# EAGLE design pcb_1-1.0 (EAGLE 5.02)
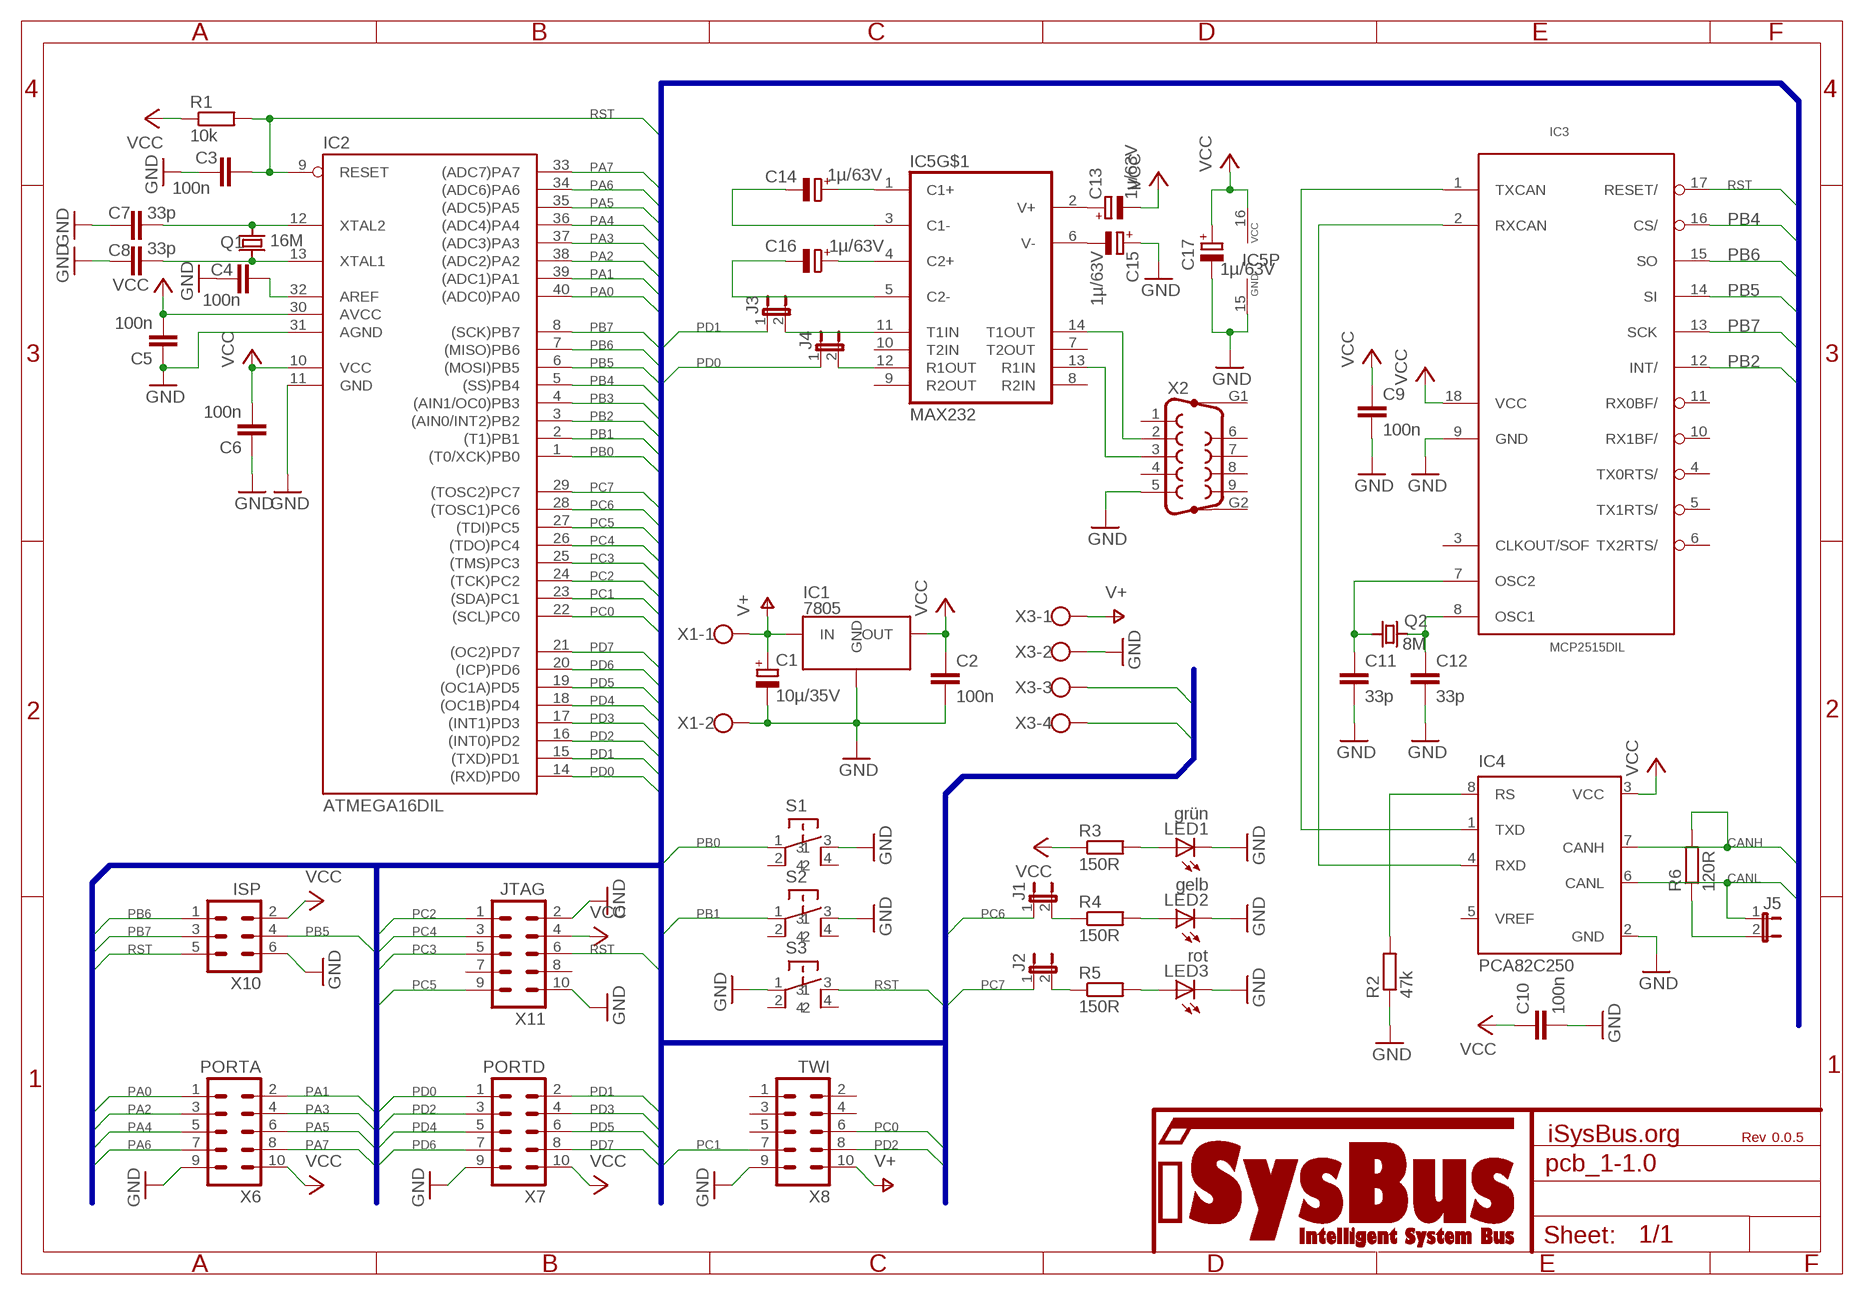
[diagram p0: schematic, sheet 1]

## Parts
C1  10µ/35V  CPOLE2-5  [E2-5]
C2  100n  C050-030X075  [C050-030X075]
C3  100n  C050-030X075  [C050-030X075]
C4  100n  C050-030X075  [C050-030X075]
C5  100n  C050-030X075  [C050-030X075]
C6  100n  C050-030X075  [C050-030X075]
C7  33p  C025-025X050  [C025-025X050]
C8  33p  C025-025X050  [C025-025X050]
C9  100n  C050-030X075  [C050-030X075]
C10  100n  C050-030X075  [C050-030X075]
C11  33p  C025-025X050  [C025-025X050]
C12  33p  C025-025X050  [C025-025X050]
C13  1µ/63V  CPOLE2.5-5  [E2,5-5]
C14  1µ/63V  CPOLE2.5-5  [E2,5-5]
C15  1µ/63V  CPOLE2.5-5  [E2,5-5]
C16  1µ/63V  CPOLE2.5-5  [E2,5-5]
C17  1µ/63V  CPOLE2.5-5  [E2,5-5]
IC1  7805  [TO220]
IC2  ATMEGA16DIL  [DIL40]
IC3  MCP2515DIL  [DIL18]
IC4  PCA82C250  [DIL08]
IC5  MAX232  [DIL16]
J1  J1  [J1]
J2  J1  [J1]
J3  J1  [J1]
J4  J1  [J1]
J5  J1  [J1]
LED1  grün  LED3MM  [LED3MM]
LED2  gelb  LED3MM  [LED3MM]
LED3  rot  LED3MM  [LED3MM]
Q1  16M  Q  [HC49U-V]
Q2  8M  Q  [HC49U-V]
R1  10k  R-0207/10  [0207/10]
R2  47k  R-0207/10  [0207/10]
R3  150R  R-0207/10  [0207/10]
R4  150R  R-0207/10  [0207/10]
R5  150R  R-0207/10  [0207/10]
R6  120R  R-0207/10  [0207/10]
S1  PHAP3301  [PHAP3301]
S2  PHAP3301  [PHAP3301]
S3  PHAP3301  [PHAP3301]
U$1  ISYSBUS_LOGO  [ISYSBUS_LOGO]
U$2  0.0.5  REVISION_FIELD  [REVISION_FIELD]
X1  AKL-02_101-02  [AKL-02]
X2  F09HP  [F09HP]
X3  AKL-04_101-04  [AKL-04]
X6  PORTA  ML10  [ML10]
X7  PORTD  ML10  [ML10]
X8  TWI  ML10  [ML10]
X10  ISP  ML6  [ML6]
X11  JTAG  ML10  [ML10]

## Nets
CANH: IC4.7(CANH) R6.2 X3.3
CANL: IC4.6(CANL) J5.1 X3.4
GND: C1.- C2.2 C3.1 C4.1 C5.1 C6.1 C7.2 C8.2 C9.2 C10.2 C11.2 C12.2 C15.+ C17.- IC1.2(GND) IC2.11(GND) IC2.31(AGND) IC3.9(GND) IC4.2(GND) IC5.15(P:GND) LED1.K(C) LED2.K(C) LED3.K(C) R2.1 S1.3 S2.3 S3.1 X1.2 X2.5 X3.2 X6.9 X7.9 X8.9 X10.6 X11.2 X11.10
N$1: IC5.13(R1IN) X2.3
N$2: IC5.14(T1OUT) X2.2
N$3: J5.2 R6.1
N$4: LED1.A R3.2
N$5: LED2.A R4.2
N$6: C4.2 IC2.32(AREF)
N$7: LED3.A R5.2
N$8: C8.1 IC2.13(XTAL1) Q1.2
N$9: C7.1 IC2.12(XTAL2) Q1.1
N$10: J1.2 R4.1
N$11: C12.1 IC3.8(OSC1) Q2.2
N$12: C11.1 IC3.7(OSC2) Q2.1
N$13: IC3.1(TXCAN) IC4.1(TXD)
N$14: IC3.2(RXCAN) IC4.4(RXD)
N$15: J2.2 R5.1
N$16: IC4.8(RS) R2.2
N$17: C14.+ IC5.1(C1+)
N$18: C16.+ IC5.4(C2+)
N$19: C14.- IC5.3(C1-)
N$20: C16.- IC5.5(C2-)
N$21: C13.+ IC5.2(V+)
N$22: C15.- IC5.6(V-)
N$23: IC5.12(R1OUT) J4.2
N$24: IC5.11(T1IN) J3.2
PA0: IC2.40((ADC0)PA0) X6.1
PA1: IC2.39((ADC1)PA1) X6.2
PA2: IC2.38((ADC2)PA2) X6.3
PA3: IC2.37((ADC3)PA3) X6.4
PA4: IC2.36((ADC4)PA4) X6.5
PA5: IC2.35((ADC5)PA5) X6.6
PA6: IC2.34((ADC6)PA6) X6.7
PA7: IC2.33((ADC7)PA7) X6.8
PB0: IC2.1((T0/XCK)PB0) S1.1
PB1: IC2.2((T1)PB1) S2.1
PB2: IC2.3((AIN0/INT2)PB2) IC3.12(INT/)
PB3: IC2.4((AIN1/OC0)PB3)
PB4: IC2.5((SS)PB4) IC3.16(CS/)
PB5: IC2.6((MOSI)PB5) IC3.14(SI) X10.4
PB6: IC2.7((MISO)PB6) IC3.15(SO) X10.1
PB7: IC2.8((SCK)PB7) IC3.13(SCK) X10.3
PC0: IC2.22((SCL)PC0) X8.6
PC1: IC2.23((SDA)PC1) X8.7
PC2: IC2.24((TCK)PC2) X11.1
PC3: IC2.25((TMS)PC3) X11.5
PC4: IC2.26((TDO)PC4) X11.3
PC5: IC2.27((TDI)PC5) X11.9
PC6: IC2.28((TOSC1)PC6) J1.1
PC7: IC2.29((TOSC2)PC7) J2.1
PD0: IC2.14((RXD)PD0) J4.1 X7.1
PD1: IC2.15((TXD)PD1) J3.1 X7.2
PD2: IC2.16((INT0)PD2) X7.3 X8.8
PD3: IC2.17((INT1)PD3) X7.4
PD4: IC2.18((OC1B)PD4) X7.5
PD5: IC2.19((OC1A)PD5) X7.6
PD6: IC2.20((ICP)PD6) X7.7
PD7: IC2.21((OC2)PD7) X7.8
RST: C3.2 IC2.9(RESET) IC3.17(RESET/) R1.2 S3.3 X10.5 X11.6
V+: C1.+ IC1.1(IN) X1.1 X3.1 X8.10
VCC: C2.1 C5.2 C6.2 C9.1 C10.1 C13.- C17.+ IC1.3(OUT) IC2.10(VCC) IC2.30(AVCC) IC3.18(VCC) IC4.3(VCC) IC5.16(P:VCC) R1.1 R3.1 X6.10 X7.10 X10.2 X11.4
Unconnected: IC3.3(CLKOUT/SOF) IC3.4(TX0RTS/) IC3.5(TX1RTS/) IC3.6(TX2RTS/) IC3.10(RX1BF/) IC3.11(RX0BF/) IC4.5(VREF) IC5.7(T2OUT) IC5.8(R2IN) IC5.9(R2OUT) IC5.10(T2IN) S1.2 S1.4 S2.2 S2.4 S3.2 S3.4 X2.1 X2.4 X2.6 X2.7 X2.8 X2.9 X2.G1 X2.G2 X8.1 X8.2 X8.3 X8.4 X8.5 X11.7 X11.8

## Buses
RST,PA[0..7],PB[0..7],PC[0..7],PD[0..7],CANH,CANL

## Library data of the parts
C1 C13-C17 = isb_capacitors:CPOL: POLARIZED CAPACITOR, European symbol
C2-C12 = isb_capacitors:C: CAPACITOR, European symbol
IC1 = isb_supply:7805
IC2 = isb_microcontrollers:ATMEGA16DIL
IC3 = isb_interfacecontrollers:MCP2515
IC4 = isb_interfacecontrollers:PCA82C250
IC5 = isb_interfacecontrollers:MAX232: RS232 TRANSEIVER
J1-J5 = isb_connectors:J1: JUMPER
LED1-LED3 = isb_optical:LED
Q1 Q2 = isb_oscillators:Q
R1-R6 = isb_resistors:R: RESISTOR, European symbol
S1-S3 = isb_buttons:PHAP3301
U$1 = isysbus_misc:ISYSBUS_LOGO: iSysBus Logo
U$2 = isysbus_misc:REVISION_FIELD: Revision field
X1 = isb_connectors:AKL-02_: WAGO SREW CLAMP
X2 = isb_connectors:F09HP: SUB-D
X3 = isb_connectors:AKL-04_: WAGO SREW CLAMP
X6-X8 X11 = isb_connectors:ML10: HARTING
X10 = isb_connectors:ML6: HARTING

## Board
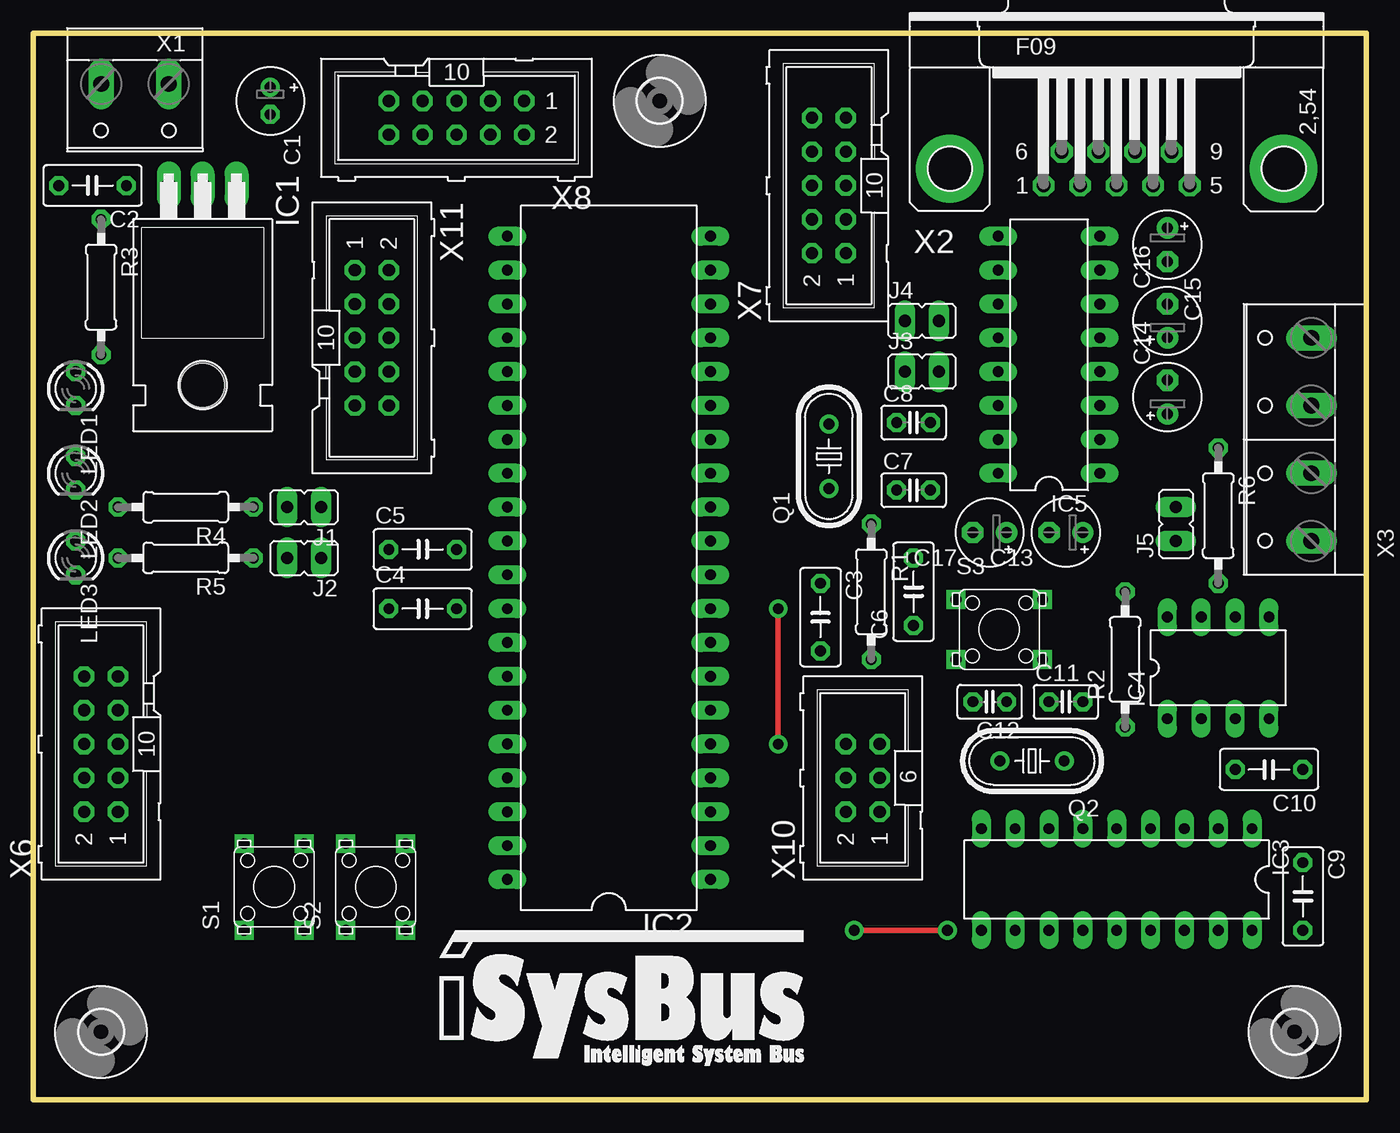
[diagram p1: board, top side]
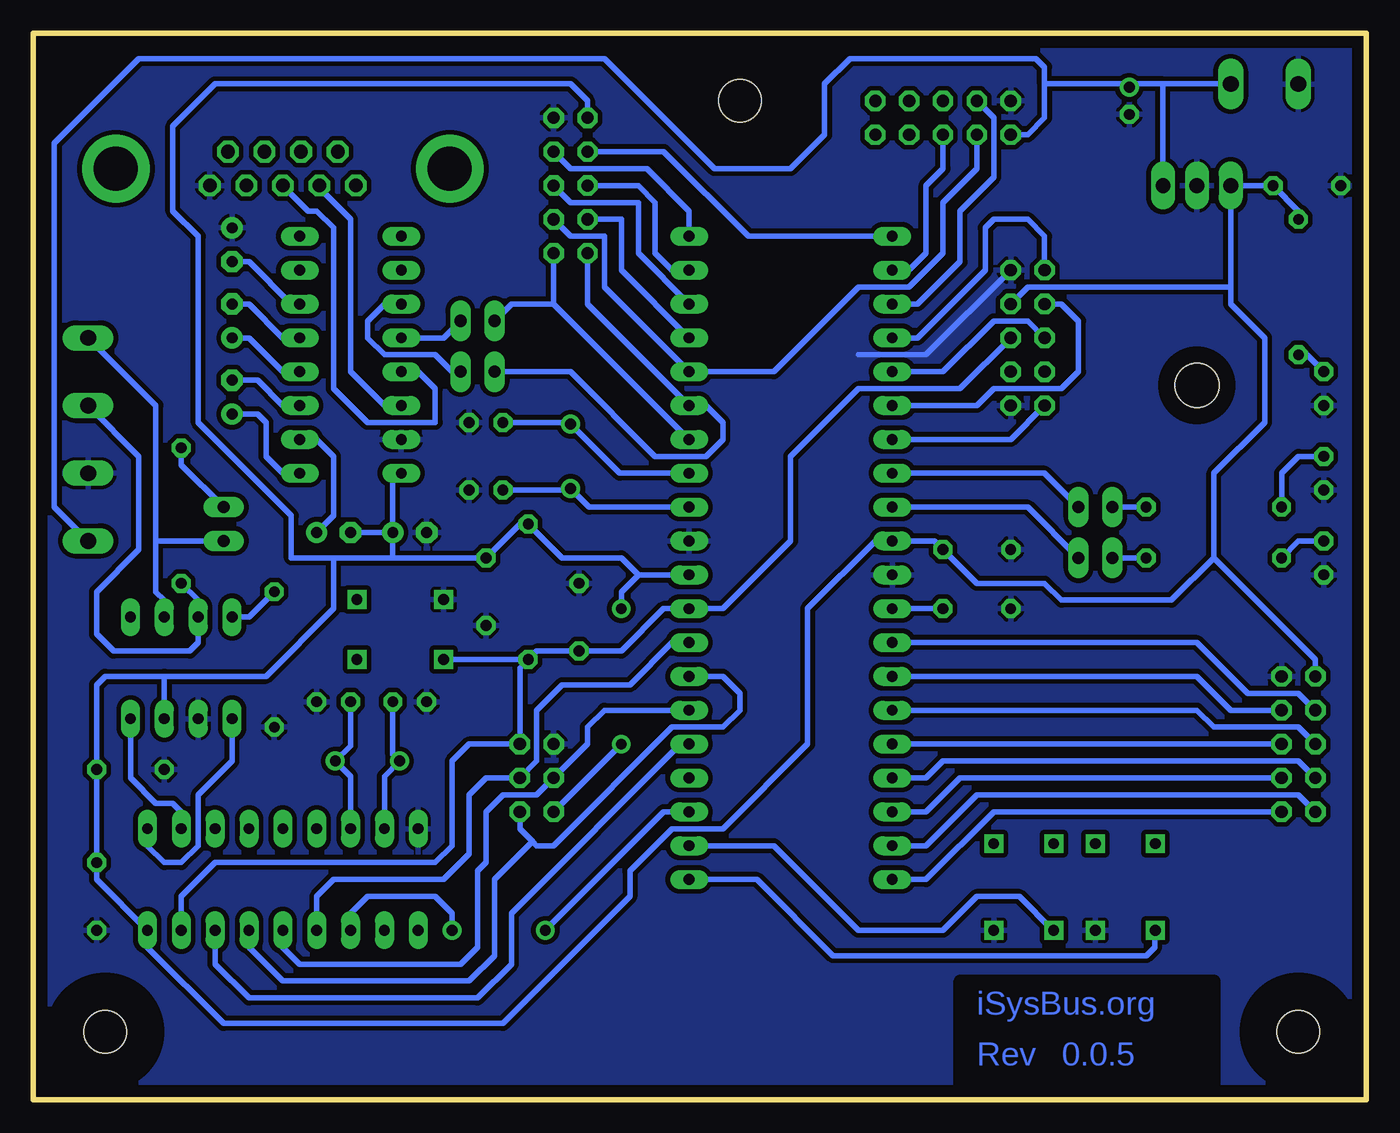
[diagram p2: board, bottom side, seen from below]

Size 100 x 80 mm. Coordinates in mm from the lower left corner, seen from the top.
Outline: 0,0 100,0 100,80 0,80 0,0
Copper layers (1*16): Top 0.035mm / dielectric 1.5mm / Bottom 0.035mm
Design rules "hausbus": minimum track width 12mil, minimum drill 31mil, track to track 10mil, track to pad 10mil, pad to pad 10mil, via to via 10mil, smd to smd 8mil, copper to edge 35mil, drill to drill 8mil, minimum pad ring 12mil, minimum via ring 12mil, stop-mask expansion 4mil, vias tented up to drill 0mil, thermal gap 10mil

### Footprints (pad centres in the part's own frame; a part is rotated, then mirrored left to right if it is on the bottom)
E2-5 = drill 0.813 pad 1.27 round: + -1.016,0 | drill 0.813 pad 1.27 octagon: - 1.016,0
C050-030X075 = drill 0.813 octagon: 1 -2.54,0; 2 2.54,0
C025-025X050 = drill 0.813 octagon: 1 -1.27,0; 2 1.27,0
E2,5-5 = drill 0.813 pad 1.6 round: + -1.27,0 | drill 0.813 pad 1.6 octagon: - 1.27,0
TO220 = drill 1.118 long: 1 -2.54,-10.16; 2 0,-10.16; 3 2.54,-10.16 | hole 3.302: 0,4.826
DIL40 = drill 0.813 long: 1 -24.13,-7.62; 2 -21.59,-7.62; 3 -19.05,-7.62; 4 -16.51,-7.62; 5 -13.97,-7.62; 6 -11.43,-7.62; 7 -8.89,-7.62; 8 -6.35,-7.62; 9 -3.81,-7.62; 10 -1.27,-7.62; 11 1.27,-7.62; 12 3.81,-7.62; 13 6.35,-7.62; 14 8.89,-7.62; 15 11.43,-7.62; 16 13.97,-7.62; 17 16.51,-7.62; 18 19.05,-7.62; 19 21.59,-7.62; 20 24.13,-7.62; 21 24.13,7.62; 22 21.59,7.62; 23 19.05,7.62; 24 16.51,7.62; 25 13.97,7.62; 26 11.43,7.62; 27 8.89,7.62; 28 6.35,7.62; 29 3.81,7.62; 30 1.27,7.62; 31 -1.27,7.62; 32 -3.81,7.62; 33 -6.35,7.62; 34 -8.89,7.62; 35 -11.43,7.62; 36 -13.97,7.62; 37 -16.51,7.62; 38 -19.05,7.62; 39 -21.59,7.62; 40 -24.13,7.62
DIL18 = drill 0.813 long: 1 -10.16,-3.81; 2 -7.62,-3.81; 3 -5.08,-3.81; 4 -2.54,-3.81; 5 0,-3.81; 6 2.54,-3.81; 7 5.08,-3.81; 8 7.62,-3.81; 9 10.16,-3.81; 10 10.16,3.81; 11 7.62,3.81; 12 5.08,3.81; 13 2.54,3.81; 14 0,3.81; 15 -2.54,3.81; 16 -5.08,3.81; 17 -7.62,3.81; 18 -10.16,3.81
DIL08 = drill 0.813 long: 1 -3.81,-3.81; 2 -1.27,-3.81; 3 1.27,-3.81; 4 3.81,-3.81; 5 3.81,3.81; 6 1.27,3.81; 7 -1.27,3.81; 8 -3.81,3.81
DIL16 = drill 0.813 long: 1 -8.89,-3.81; 2 -6.35,-3.81; 3 -3.81,-3.81; 4 -1.27,-3.81; 5 1.27,-3.81; 6 3.81,-3.81; 7 6.35,-3.81; 8 8.89,-3.81; 9 8.89,3.81; 10 6.35,3.81; 11 3.81,3.81; 12 1.27,3.81; 13 -1.27,3.81; 14 -3.81,3.81; 15 -6.35,3.81; 16 -8.89,3.81
J1 = drill 0.914 long: 1 0,-1.27; 2 0,1.27
LED3MM = drill 0.813 octagon: A -1.27,0; K 1.27,0
HC49U-V = drill 0.813 round: 1 -2.413,0; 2 2.413,0
0207/10 = drill 0.813 octagon: 1 -5.08,0; 2 5.08,0
PHAP3301 = drill 0.8 square: 1 0,4.5; 2 6.5,4.5; 3 0,0; 4 6.5,0
3,2 = hole 3.2: 0,0
AKL-02 = drill 1.194 long: 1 -2.54,-0.635; 2 2.54,-0.635
F09HP = drill 1.016 octagon: 1 -5.486,-1.27; 2 -2.743,-1.27; 3 0,-1.27; 4 2.743,-1.27; 5 5.486,-1.27; 6 -4.115,1.27; 7 -1.372,1.27; 8 1.372,1.27; 9 4.115,1.27 | drill 3.302 pad 5.08 round: G1 -12.522,0; G2 12.522,0
AKL-04 = drill 1.194 long: 1 -7.62,-0.635; 2 -2.54,-0.635; 3 2.54,-0.635; 4 7.62,-0.635
ML10 = drill 0.914 octagon: 1 -5.08,-1.27; 2 -5.08,1.27; 3 -2.54,-1.27; 4 -2.54,1.27; 5 0,-1.27; 6 0,1.27; 7 2.54,-1.27; 8 2.54,1.27; 9 5.08,-1.27; 10 5.08,1.27
ML6 = drill 0.914 octagon: 1 -2.54,-1.27; 2 -2.54,1.27; 3 0,-1.27; 4 0,1.27; 5 2.54,-1.27; 6 2.54,1.27

### Placement (x,y rotation side)
C1  17.78,74.93 270 top
C2  4.45,68.58 180 top
C3  59.05,36.2 270 top
C4  29.21,36.83 0 top
C5  29.21,41.27 0 top
C6  66.04,38.1 90 top
C7  66.04,45.72 0 top
C8  66.04,50.8 0 top
C9  95.25,15.24 270 top
C10  92.71,24.77 180 top
C11  77.47,29.84 0 top
C12  71.75,29.84 180 top
C13  77.47,42.55 180 top
C14  85.09,52.7 90 top
C15  85.09,64.14 270 top
C16  85.09,58.42 90 top
C17  71.75,42.55 180 top
IC1  12.7,58.42 180 top
IC2  43.18,40.64 90 top
IC3  81.28,16.51 180 top
IC4  88.9,32.38 0 top
IC5  76.2,55.88 90 top
J1  20.32,44.45 90 top
J2  20.32,40.64 90 top
J3  66.67,54.61 270 top
J4  66.67,58.42 270 top
J5  85.72,43.18 0 top
LED1  3.17,53.34 270 top
LED2  3.17,46.99 270 top
LED3  3.17,40.64 270 top
Q1  59.69,48.26 90 top
Q2  74.93,25.4 180 top
R1  62.87,38.1 270 top
R2  81.92,33.02 90 top
R3  5.08,60.96 270 top
R4  11.43,44.45 180 top
R5  11.43,40.64 180 top
R6  88.9,43.81 270 top
S1  20.32,12.7 90 top
S2  27.94,12.7 90 top
S3  69.22,33.02 0 top
U$1  30.48,2.54 0 top
U$2  30.48,1.27 0 bottom
U$3  [3,2]  46.99,74.93 0 top
U$4  [3,2]  94.61,5.08 0 top
U$5  [3,2]  5.08,5.08 0 top
X1  7.62,75.56 180 top
X2  81.28,69.85 0 top
X3  95.25,49.53 90 top
X6  5.08,26.67 90 top
X7  59.69,68.58 90 top
X8  31.75,73.66 180 top
X10  62.23,24.13 90 top
X11  25.4,57.15 270 top

### Tracks (layer width: path | path; a pad name or v marks a point on that pad's centre or on a via)
CANH
  Bottom 0.406: X3.3 92.08,48.26 92.08,41.27 95.25,38.1 95.25,34.92 93.98,33.66 88.27,33.66 87.63,34.29 IC4.7 87.63,37.47 R6.2
CANL
  Bottom 0.406: X3.4 90.81,52.07 90.81,41.91 | IC4.6 90.17,37.47 90.81,38.1 90.81,41.91 | J5.1 90.81,41.91
GND
  Bottom 0.406: 38.1,55.88 33.02,55.88 X11.2
  pour Bottom (isolate 0.356): 101,-1 101,81 -1,81 -1,-1
N$1
  Bottom 0.406: IC5.13 71.12,54.61 69.85,53.34 69.85,50.8 74.93,50.8 77.47,53.34 77.47,65.41 78.74,66.67 79.38,66.67 X2.3
N$2
  Bottom 0.406: IC5.14 73.66,52.07 76.2,54.61 76.2,66.04 78.54,68.38 X2.2
N$3
  Bottom 0.406: R6.1 88.9,47.62 J5.2
N$4
  Bottom 0.406: LED1.A 4.45,55.88 R3.2
N$5
  Bottom 0.406: LED2.A 5.08,48.26 6.35,46.99 R4.2
N$6
  Bottom 0.406: C4.2 IC2.32
N$7
  Bottom 0.406: LED3.A 5.08,41.91 R5.2
N$8
  Bottom 0.406: C8.1 59.82,50.8 Q1.2 56.01,46.99 IC2.13
N$9
  Bottom 0.406: C7.1 59.82,45.72 Q1.1 58.29,44.45 IC2.12
N$10
  Bottom 0.406: R4.1 J1.2
N$11
  Bottom 0.406: IC3.8 73.66,24.26 Q2.2 73.03,25.91 C12.1
N$12
  Bottom 0.406: IC3.7 76.2,24.26 Q2.1 76.2,26.54 C11.1
N$13
  Bottom 0.406: IC3.1 91.44,19.05 90.17,17.78 88.9,17.78 87.63,19.05 87.63,22.86 85.09,25.4 IC4.1
N$14
  Bottom 0.406: IC3.2 88.9,21.59 89.53,22.23 90.81,22.23 92.71,24.13 IC4.4
N$15
  Bottom 0.406: R5.1 J2.2
N$16
  Bottom 0.406: IC4.8 83.82,36.2 R2.2
N$17
  Bottom 0.406: IC5.1 81.28,46.99 82.55,48.26 82.55,50.8 83.19,51.44 C14.+
N$18
  Bottom 0.406: IC5.4 81.28,54.61 83.82,57.15 C16.+
N$19
  Bottom 0.406: IC5.3 81.28,52.07 83.19,53.98 C14.-
N$20
  Bottom 0.406: IC5.5 81.28,57.15 83.82,59.69 C16.-
N$21
  Bottom 0.406: C13.+ 77.47,43.81 77.47,48.26 78.74,49.53 IC5.2
N$22
  Bottom 0.406: IC5.6 80.64,59.69 83.82,62.87 C15.-
N$23
  Bottom 0.406: IC5.12 69.22,57.15 J4.2
N$24
  Bottom 0.406: IC5.11 73.66,59.69 74.93,58.42 74.93,57.15 73.66,55.88 69.85,55.88 68.58,54.61 J3.2
PA0
  Bottom 0.406: IC2.40 33.02,16.51 27.94,21.59 X6.1
PA1
  Bottom 0.406: IC2.39 33.02,19.05 29.21,22.86 5.08,22.86 X6.2
PA2
  Bottom 0.406: IC2.38 33.02,21.59 30.48,24.13 X6.3
PA3
  Bottom 0.406: IC2.37 33.02,24.13 31.75,25.4 5.08,25.4 X6.4
PA4
  Bottom 0.406: X6.5 IC2.36
PA5
  Bottom 0.406: IC2.35 12.7,29.21 11.43,27.94 5.08,27.94 X6.6
PA6
  Bottom 0.406: IC2.34 12.7,31.75 10.16,29.21 X6.7
PA7
  Bottom 0.406: IC2.33 12.7,34.29 8.89,30.48 5.08,30.48 X6.8
PB0
  Bottom 0.406: IC2.1 45.72,16.51 40.01,10.79 16.51,10.79 15.88,11.43 15.88,12.7 S1.1
PB1
  Bottom 0.406: IC2.2 44.45,19.05 38.1,12.7 31.75,12.7 29.21,15.24 26.04,15.24 23.5,12.7 S2.1
PB2  (via drill 0.8)
  Top 0.406: v61.59,12.7 v68.58,12.7
  Bottom 0.406: IC2.3 52.7,21.59 v61.59,12.7 | v68.58,12.7 68.58,13.97 69.85,15.24 74.93,15.24 76.2,13.97 IC3.12
PB4
  Bottom 0.406: IC2.5 51.44,26.67 64.14,13.97 64.14,10.16 66.67,7.62 83.82,7.62 86.36,10.16 IC3.16
PB5
  Bottom 0.406: IC2.6 57.15,29.21 58.42,27.94 58.42,26.67 X10.4 62.23,22.86 64.77,22.86 66.04,21.59 66.04,17.78 66.67,17.14 66.67,11.43 67.94,10.16 80.01,10.16 81.28,11.43 IC3.14
PB6
  Bottom 0.406: IC2.7 48.26,31.75 46.99,30.48 46.99,29.21 48.26,27.94 52.07,27.94 60.96,19.05 62.23,19.05 62.55,19.37 | 62.55,19.37 63.5,20.32 X10.1 | IC3.15 83.82,11.43 81.28,8.89 67.31,8.89 65.41,10.79 65.41,16.51 62.55,19.37
PB7
  Bottom 0.406: IC2.8 52.07,34.29 55.24,31.11 60.33,31.11 62.23,29.21 62.23,25.4 X10.3 66.04,24.13 67.31,22.86 67.31,18.41 69.22,16.51 77.47,16.51 78.74,15.24 IC3.13
PC0
  Bottom 0.406: IC2.22 34.29,62.23 33.02,63.5 33.02,68.58 31.75,69.85 X8.6
PC1
  Bottom 0.406: IC2.23 33.66,59.69 30.48,62.87 30.48,66.67 27.94,69.22 27.94,73.66 X8.7
PC2
  Bottom 0.406: IC2.24 33.66,57.15 28.57,62.23 28.57,65.41 27.94,66.04 25.4,66.04 24.13,64.77 X11.1
PC3
  Bottom 0.406: IC2.25 31.75,54.61 27.94,58.42 25.4,58.42 X11.5
PC4
  Bottom 0.406: IC2.26 29.21,52.07 27.94,53.34 22.86,53.34 21.59,54.61 21.59,58.42 22.86,59.69 X11.3
PC5
  Bottom 0.406: IC2.27 26.67,49.53 X11.9
PC6
  Bottom 0.406: IC2.28 24.13,46.99 J1.1
PC7
  Bottom 0.406: IC2.29 25.4,44.45 J2.1
PD0
  Bottom 0.406: IC2.14 60.96,59.69 | 60.96,59.69 64.14,59.69 J4.1 | 60.96,59.69 X7.1
PD1
  Bottom 0.406: X7.2 58.42,59.69 IC2.15 49.53,52.07 48.26,50.8 48.26,49.53 49.53,48.26 53.34,48.26 59.69,54.61 J3.1
PD2
  Bottom 0.406: X7.3 59.69,64.77 57.15,64.77 57.15,60.96 IC2.16 44.45,54.61 38.1,60.96 34.29,60.96 31.75,63.5 31.75,67.31 29.21,69.85 X8.8
PD3
  Bottom 0.406: IC2.17 55.88,62.23 55.88,66.04 X7.4
PD4
  Bottom 0.406: IC2.18 54.61,63.5 54.61,67.31 59.69,67.31 X7.5
PD5
  Bottom 0.406: IC2.19 52.07,62.23 53.34,63.5 53.34,67.31 54.61,68.58 X7.6
PD6
  Bottom 0.406: IC2.20 50.8,66.67 53.98,69.85 59.69,69.85 X7.7
PD7
  Bottom 0.406: IC2.21 46.35,64.77 52.7,71.12 X7.8
RST
  Bottom 0.406: IC3.17 88.9,15.24 86.36,17.78 69.85,17.78 68.58,19.05 68.58,25.4 67.31,26.67 X10.5 63.5,32.38 R1.2 | R1.2 62.23,33.66 C3.2 55.88,33.66 52.7,36.83 IC2.9 48.26,36.83 43.18,41.91 43.18,48.26 38.1,53.34 30.48,53.34 X11.6 | R1.2 S3.3
V+
  Bottom 0.406: X3.1 98.42,44.45 98.42,71.75 92.08,78.11 57.15,78.11 48.9,69.85 43.18,69.85 40.64,72.39 40.64,76.2 38.73,78.11 24.77,78.11 24.13,77.47 24.13,76.2 | 24.13,76.2 24.13,73.66 25.4,72.39 X8.10 | IC1.1 15.24,76.2 | 15.24,76.2 X1.1 | 15.24,76.2 17.78,76.2 | 17.78,76.2 C1.+ | 17.78,76.2 24.13,76.2
VCC  (via drill 0.8)
  Top 0.406: v55.88,36.83 v55.88,26.67
  Bottom 0.406: 10.16,60.96 IC1.3 C2.1 5.08,66.67 R3.1 | 10.16,60.96 25.4,60.96 X11.4 | 10.16,60.96 10.16,59.69 7.62,57.15 7.62,50.8 11.43,46.99 11.43,40.64 | 54.61,39.37 IC2.10 | 54.61,39.37 55.88,40.64 60.33,40.64 R1.1 63.5,43.18 C6.2 73.03,40.64 | v55.88,36.83 55.88,38.1 54.61,39.37 | 95.25,16.51 IC3.18 91.44,11.43 85.72,5.71 64.77,5.71 55.24,15.24 55.24,17.14 52.07,20.32 48.26,20.32 41.91,26.67 41.91,36.83 36.83,41.91 IC2.30 32.38,41.91 C5.2 29.21,38.73 24.13,38.73 22.86,37.47 14.61,37.47 11.43,40.64 | 90.17,31.75 94.61,31.75 95.25,31.11 C10.1 95.25,16.51 | 90.17,31.75 IC4.3 | 90.17,31.75 82.55,31.75 77.47,36.83 77.47,40.64 | C17.+ C13.- | IC5.16 73.03,46.35 C17.+ | 73.03,40.64 C17.+ | 77.47,40.64 73.03,40.64 | 77.47,40.64 80.64,40.64 80.64,43.81 87.63,50.8 87.63,64.77 89.53,66.67 89.53,73.03 86.36,76.2 59.69,76.2 58.42,74.93 X7.10 | 11.43,40.64 3.81,33.02 X6.10 | 95.25,16.51 C9.1 | v55.88,26.67 X10.2